# EAGLE design ver3 (EAGLE 9.6.2)
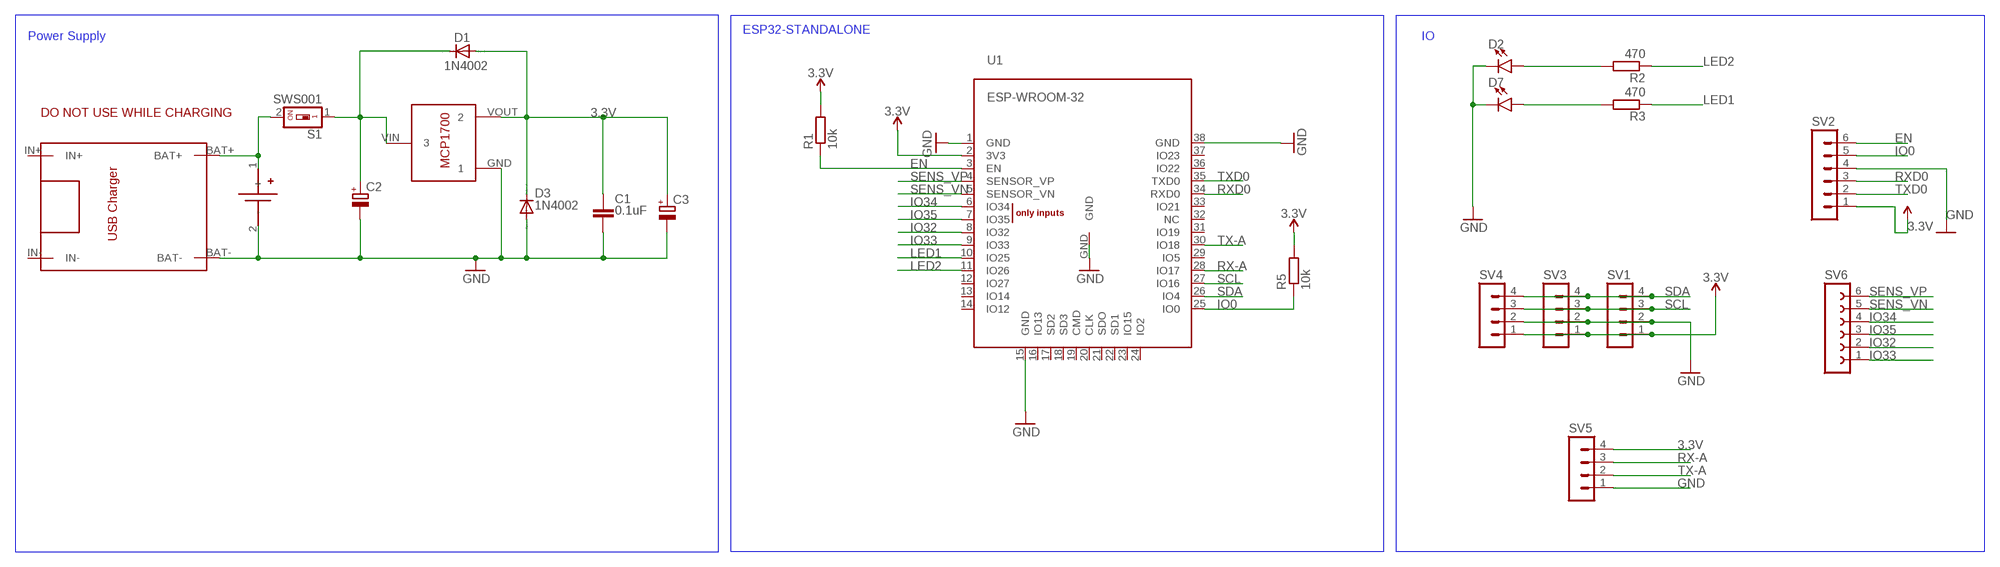
[diagram p0: schematic, sheet 1]

## Parts
C1  0.1uF  C-EU075-052X106  [C075-052X106]
C2  CPOL-EU085CS-1AR  [085CS_1AR]
C3  CPOL-EU085CS-1AR  [085CS_1AR]
D1  1N4002  1N4004  [DO41-10]
D2  LED-3MM-NO_SILK  [LED_3MM-NS]
D3  1N4002  1N4004  [DO41-10]
D7  LED-3MM-NO_SILK  [LED_3MM-NS]
R1  10k  R-EU_R0603  [R0603]
R2  470  R-EU_R0603  [R0603]
R3  470  R-EU_R0603  [R0603]
R5  10k  R-EU_R0603  [R0603]
S1  SWS001  [SMS-001]
SV1  MA04-1  [MA04-1]
SV2  MA06-1  [MA06-1]
SV3  MA04-1  [MA04-1]
SV4  MA04-1  [MA04-1]
SV5  MA04-1  [MA04-1]
SV6  FE06-1  [FE06]
U1  ESP-WROOM-32  [ESP-WROOM-32]
U$1  BLOSSOM-BLM-18650-1PCS  [BLOSSOM-BLM-18650-1PCS]
U$2  TP4056  [TP4056]
U$3  MCP1700T-3302E/TT  [MCP1700T-3302E/TT]

## Nets
3.3V: C1.1 C3.+ D1.A D3.C R1.2 R5.2 SV1.1 SV2.1 SV3.1 SV4.1 SV5.4 U1.2(3V3) U$3.VOUT
EN: R1.1 SV2.6 U1.3(EN)
GND: C1.2 C2.- C3.- D2.K(C) D3.A D7.K(C) SV1.2 SV2.4 SV3.2 SV4.2 SV5.1 U1.1(GND) U1.15(GND) U1.38(GND) U1.GND U$1.2(-) U$2.BAT- U$3.GND
GREEN-A: D7.A R3.2
IO0: R5.1 SV2.5 U1.25(IO0)
IO32: SV6.2 U1.8(IO32)
IO33: SV6.1 U1.9(IO33)
IO34: SV6.4 U1.6(IO34)
IO35: SV6.3 U1.7(IO35)
LED1: R3.1 U1.10(IO25)
LED2: R2.1 U1.11(IO26)
N$5: S1.2 U$1.1(+) U$2.BAT+
RX-A: SV5.3 U1.28(IO17)
RXD0: SV2.3 U1.34(RXD0)
SCL: SV1.3 SV3.3 SV4.3 U1.27(IO16)
SDA: SV1.4 SV3.4 SV4.4 U1.26(IO4)
SENS_VN: SV6.5 U1.5(SENSOR_VN)
SENS_VP: SV6.6 U1.4(SENSOR_VP)
TX-A: SV5.2 U1.30(IO18)
TXD0: SV2.2 U1.35(TXD0)
VIN: C2.+ D1.C S1.1 U$3.VIN
YELLOW-A: D2.A R2.2
Unconnected: U1.12(IO27) U1.13(IO14) U1.14(IO12) U1.16(IO13) U1.17(SD2) U1.18(SD3) U1.19(CMD) U1.20(CLK) U1.21(SDO) U1.22(SD1) U1.23(IO15) U1.24(IO2) U1.29(IO5) U1.31(IO19) U1.32(NC) U1.33(IO21) U1.36(IO22) U1.37(IO23) U$2.IN+ U$2.IN-

## Notes on the sheet
- ESP32-STANDALONE
- Power Supply | IO
- DO NOT USE WHILE CHARGING

## Library data of the parts
C1 = rcl:C-EU: CAPACITOR, European symbol
C2 C3 = rcl:CPOL-EU: POLARIZED CAPACITOR, European symbol; SPICEPREFIX: C
D1 D3 = diode:1N4004: DIODE general purpose rectifier, 1 A
D2 D7 = SparkFun-LED:LED: LED (Generic) Standard schematic elements and footprints for 5mm, 3mm, 1206, and 0603 sized LEDs. Generic LEDs with no color specified.
R1-R3 R5 = rcl:R-EU_: RESISTOR, European symbol
S1 = smd-special:SWS001: SMD Dip Switch 1 pol.
SV1 SV3-SV5 = con-lstb:MA04-1: PIN HEADER; OC_FARNELL: unknown; OC_NEWARK: unknown
SV2 = con-lstb:MA06-1: PIN HEADER; OC_FARNELL: unknown; OC_NEWARK: unknown
SV6 = con-lsta:FE06-1: FEMALE HEADER; OC_FARNELL: unknown; OC_NEWARK: unknown
U1 = bSmart:ESP-WROOM-32: ESP32 mod by bSmart
U$1 = battery-holders:BLOSSOM-BLM-18650-1PCS
U$2 = TP4056 charging module:TP4056
U$3 = MCP1700T-3302E_TT:MCP1700T-3302E/TT: Microchip LDO "MCP1700" in a 3-Pin SOT-23 package. ID: MCP1700T-3302E/TT

## Board
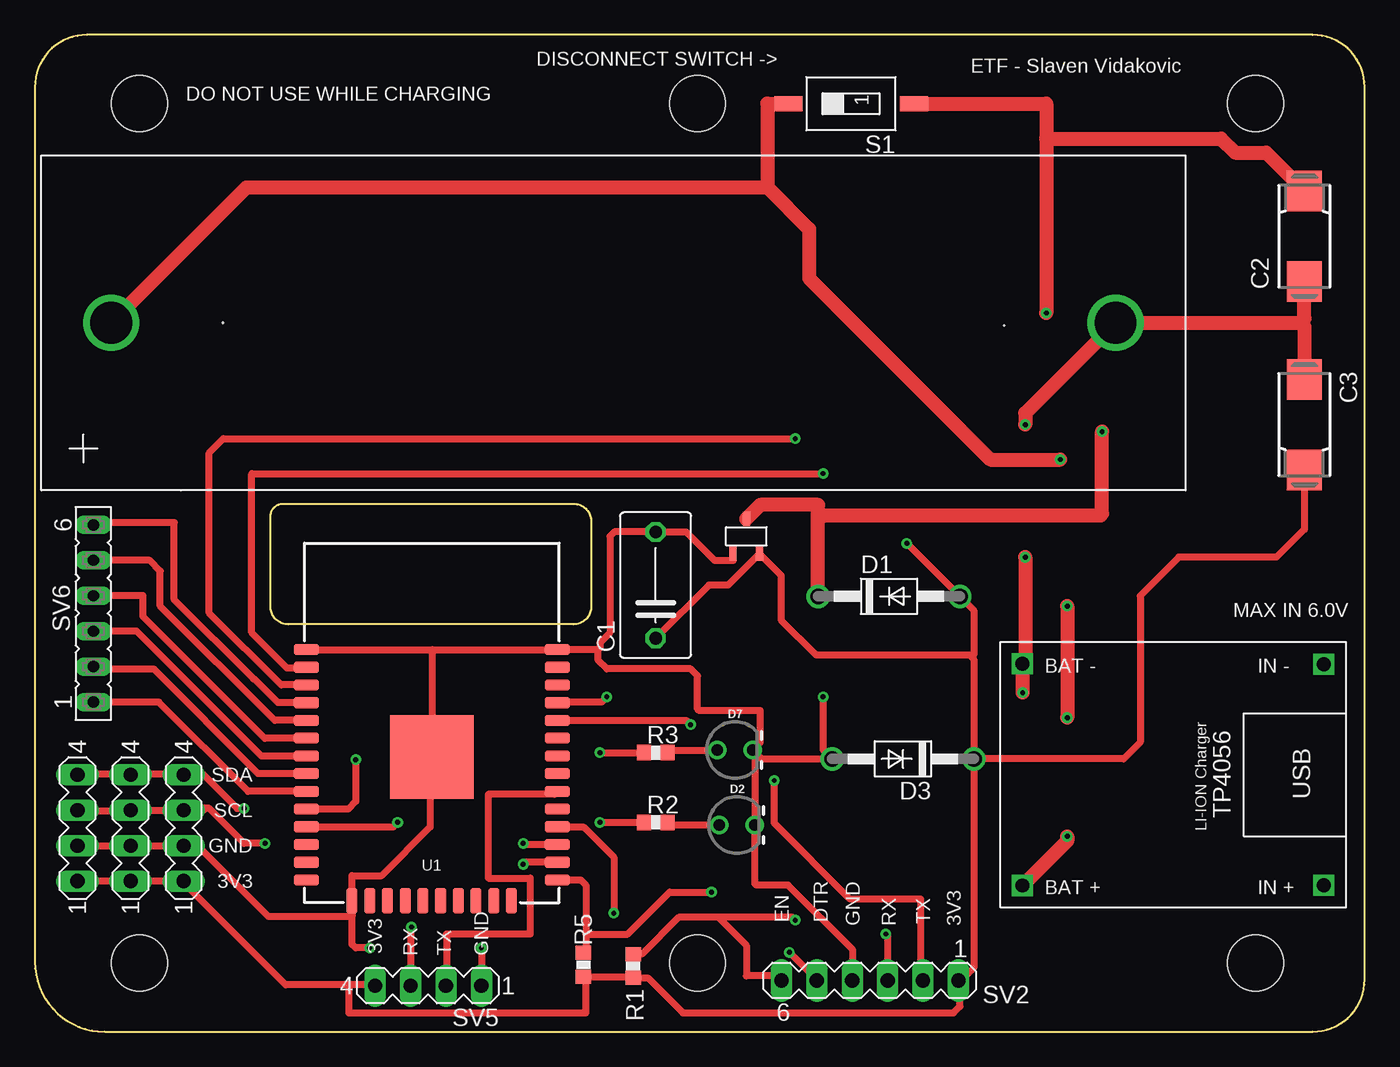
[diagram p1: board, top side]
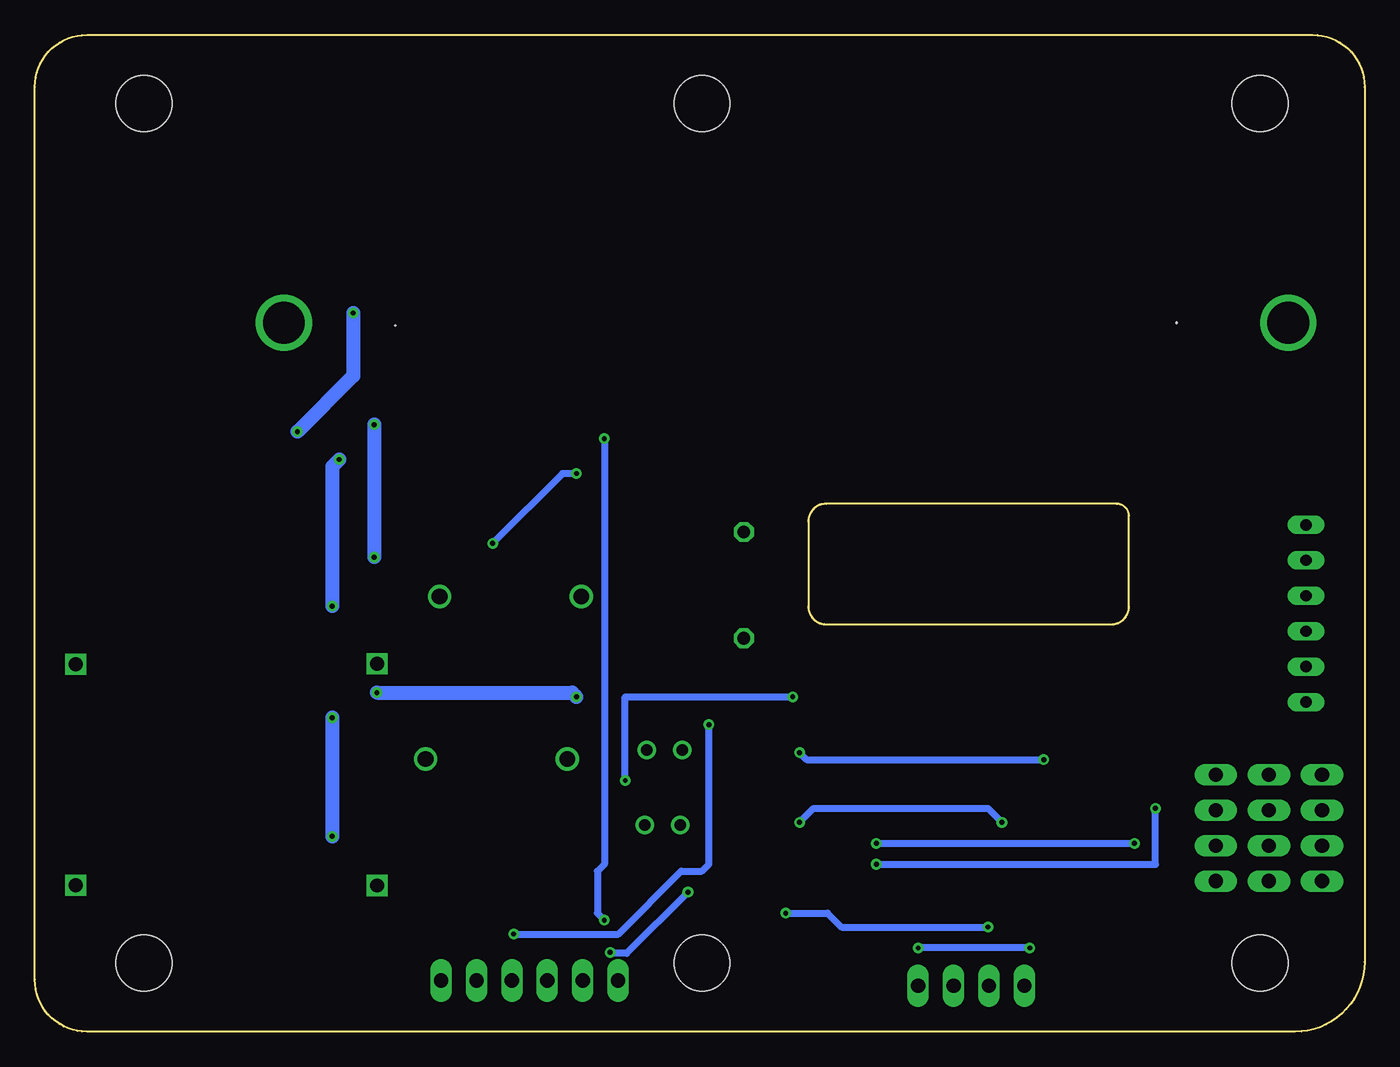
[diagram p2: board, bottom side, seen from below]

Size 95.32 x 71.43 mm. Coordinates in mm from the lower left corner, seen from the top.
Outline: 16.89,30.46 16.89,36.94 arc-90 17.78,37.83 38.61,37.83 arc-90 39.88,36.56 39.88,30.46 arc-90 38.61,29.19 18.16,29.19 arc-90 16.89,30.46
Outline: 5,0 91.59,0 arc90 95.32,3.73 95.32,67.7 arc90 91.59,71.43 3.73,71.43 arc90 0,67.7 0,5 arc90 5,0
Copper layers (1*16): Top 0.035mm / dielectric 1.5mm / Bottom 0.035mm
Design rules "default *": minimum track width 6mil, minimum drill 0.35mm, track to track 6mil, track to pad 6mil, pad to pad 6mil, via to via 6mil, smd to smd 6mil, copper to edge 40mil, drill to drill 6mil, minimum pad ring 10mil, minimum via ring 8mil, stop-mask expansion 4mil, vias tented up to drill 1mm, thermal gap 10mil
Holes 4 mm at 7.5,4.92 47.5,4.92 7.5,66.51 87.5,66.51 87.5,4.92 47.5,66.51

### Footprints (pad centres in the part's own frame; a part is rotated, then mirrored left to right if it is on the bottom)
C075-052X106 = drill 0.914 octagon: 1 -3.81,0; 2 3.81,0
085CS_1AR = smd 2.9 x 2.5: + 3.25,0; - -3.25,0
DO41-10 = drill 1.118: A 5.08,0; C -5.08,0
LED_3MM-NS = drill 0.813: A -1.27,0; K 1.27,0
R0603 = smd 1 x 1.1: 1 -0.85,0; 2 0.85,0
SMS-001 = smd 1.092 x 2.007: 1 0,-4.496; 2 0,4.496
MA04-1 = drill 1.016 long: 1 -3.81,0; 2 -1.27,0; 3 1.27,0; 4 3.81,0
MA06-1 = drill 1.016 long: 1 -6.35,0; 2 -3.81,0; 3 -1.27,0; 4 1.27,0; 5 3.81,0; 6 6.35,0
FE06 = drill 0.813 long: 1 -6.35,0; 2 -3.81,0; 3 -1.27,0; 4 1.27,0; 5 3.81,0; 6 6.35,0
ESP-WROOM-32 = smd 0.8 x 1.8: 1 7.7,9; 2 6.43,9; 3 5.16,9; 4 3.89,9; 5 2.62,9; 6 1.35,9; 7 0.08,9; 8 -1.19,9; 9 -2.46,9; 10 -3.73,9; 11 -5,9; 12 -6.27,9; 13 -7.54,9; 14 -8.81,9; 25 -8.81,-9; 26 -7.54,-9; 27 -6.27,-9; 28 -5,-9; 29 -3.73,-9; 30 -2.46,-9; 31 -1.19,-9; 32 0.08,-9; 33 1.35,-9; 34 2.62,-9; 35 3.89,-9; 36 5.16,-9; 37 6.43,-9; 38 7.7,-9 | smd 1.8 x 0.8: 15 -10.3,5.715; 16 -10.3,4.445; 17 -10.3,3.175; 18 -10.3,1.905; 19 -10.3,0.635; 20 -10.3,-0.635; 21 -10.3,-1.905; 22 -10.3,-3.175; 23 -10.3,-4.445; 24 -10.3,-5.715 | smd 6 x 6: GND 0,0
BLOSSOM-BLM-18650-1PCS = drill 3: 1 -72,0; 2 0,0 | hole 0.089: -64,0; -8,-0.19
TP4056 = drill 1 pad 1.422 square: BAT+ 8.572,-10.477; BAT- -7.303,-10.477; IN+ 8.565,11.105; IN- -7.295,11.105
MCP1700T-3302E/TT = smd 0.5 x 1: GND -0.95,-1.25; VIN 0,1.25; VOUT 0.95,-1.25

### Placement (x,y rotation side)
C1  44.5,32 90 top
C2  91,57 90 top
C3  91,43.5 270 top
D1  61.23,31.2 0 top
D2  50.34,14.81 0 top
D3  62.23,19.55 180 top
D7  50.19,20.18 0 top
R1  42.89,4.71 270 top
R2  44.5,15 0 top
R3  44.5,20 0 top
R5  39.32,4.79 270 top
S1  58.5,66.5 90 top
SV1  3.05,14.61 90 top
SV2  59.86,3.67 180 top
SV3  6.86,14.61 90 top
SV4  10.67,14.61 90 top
SV5  28.19,3.3 180 top
SV6  4.19,29.97 90 top
U1  28.45,19.68 90 top
U$1  77.47,50.8 0 top
U$2  81.28,19.05 270 top
U$3  51,35.5 0 top

### Tracks (layer width: path | path; a pad name or v marks a point on that pad's centre or on a via)
3.3V  (via drill 0.35)
  Top 0.152: 3.05,10.82 SV1.1 | 6.86,10.82 SV3.1 | 19.36,26.06 U1.2 | 10.67,10.67 SV4.1
  Top 0.508: SV5.4 24.33,3.35 22.5,3.35 | 10.67,10.67 17.98,3.35 22.5,3.35 | SV4.1 6.88,10.79 6.86,10.82 | SV3.1 SV1.1 | v62.5,35 v62.51,35 D1.A 67.31,30.2 67.31,27 67,27 | 22.5,3.35 22.5,1.35 39.5,1.35 39.5,3.76 R5.2 42.8,3.94 R1.2 43.94,3.85 46.45,1.35 65.85,1.35 66.31,1.81 66.31,3.57 | 19.36,26.06 19.34,26.08 18.06,26.08 15.54,28.59 15.54,40 v56.5,40 | C1.1 48.31,32 49.7,32 U$3.VOUT 53.5,32.7 53.5,29.5 56,27 67,27 | 67,27 67.31,26.69 D3.C | D3.C 78.05,19.55 79.24,20.74 79.24,31.24 82,34 89,34 91,36 C3.+ | 66.31,3.57 SV2.1 | 66.31,3.57 67.31,4.57 D3.C
  Bottom 0.152: 10.67,10.82 SV4.1
  Bottom 0.508: v62.5,35 57.5,40 v56.5,40
EN  (via drill 0.35)
  Top 0.152: 19.51,24.84 U1.3
  Top 0.508: U1.3 17.66,24.84 12.5,30 12.5,41.5 13.5,42.5 v54.5,42.5 | v54.5,8 54.31,8.19 49,8.19 | R1.1 43.51,5.55 46.15,8.19 49,8.19 | 49,8.19 51,6.19 51,4 53.18,4 SV2.6
  Bottom 0.508: v54.5,8 55,8.5 55,11.5 54.5,12 v54.5,42.5
GND  (via drill 0.35)
  Top 0.152: 77.57,50.9 U$1.2 | 22.86,8.99 22.86,9.3 U1.15 | U1.15 22.71,9.45 22.55,9.45 U1.15 | 28.35,19.5 28.35,19.66 U1.GND 28.5,19.81 29.57,19.81 | 3.05,13.41 SV1.2 | 10.67,13.41 SV4.2 10.67,13.26
  Top 0.508: v32,6 SV5.1 | 22.73,8.27 16.73,8.27 11.66,13.34 SV4.2 SV3.2 SV1.2 | 40.38,27.39 40.5,27.5 40.5,27.87 41.22,28.59 41.22,35.5 41.53,35.81 C1.2 46.69,35.81 48.75,33.75 50.05,33.75 U$3.GND | 40.38,27.39 40.38,26.61 41,26 47,26 47.5,25.5 47.5,23.12 47.62,23 52,23 52,20.73 D7.K | v56.5,24 56.5,20.2 D3.A 52.09,19.55 D7.K | v24,6 23,6 22.73,6.27 22.73,8.27 | 28.35,19 28.35,19.5 | 28.35,19 28.5,19.15 28.5,27.39 | 28.35,19 28.35,14.68 24.86,11.19 22.73,11.19 U1.15 22.73,8.27 | 40.38,27.39 U1.38 28.5,27.39 | D7.K 51.6,20.04 D2.K 51.6,10.61 51.71,10.5 54,10.5 58.59,5.91 SV2.4 | U1.1 28.5,27.39
  Top 1.016: v71,43.5 71,44.33 U$1.2 90.7,50.8 | v71,34 71,26.55 U$2.BAT- v70.8,24.3 | 90.7,50.8 91,50.5 C3.- | 90.7,50.8 91,51.1 C2.-
  Bottom 0.152: 77.42,50.75 U$1.2
  Bottom 0.508: v24,6 v32,6
  Bottom 1.016: v71,43.5 v71,34 | v70.8,24.3 56.8,24.3 v56.5,24
GREEN-A
  Top 0.508: R3.2 45.53,20.18 D7.A
IO0  (via drill 0.35)
  Top 0.152: 39.32,5.84 R5.1 39.32,5.69 | 37.49,10.97 U1.25
  Top 0.508: U1.25 39.12,10.88 39.5,10.5 39.5,7 | 39.5,7 39.5,5.83 R5.1 | v48.5,10 45.5,10 42.5,7 39.5,7 | v54.08,5.69 56.05,3.73 SV2.5
  Bottom 0.508: v48.5,10 52.9,5.61 54,5.61 | 54,5.61 54.12,5.61 | 54,5.61 v54.08,5.69
IO32
  Top 0.152: 19.36,18.59 U1.8
  Top 0.508: U1.8 16,18.5 8.5,26 4.35,26 SV6.2
IO33
  Top 0.152: 19.36,17.37 U1.9
  Top 0.508: U1.9 15.28,17.23 8.88,23.62 SV6.1
IO34
  Top 0.152: 19.36,21.18 U1.6
  Top 0.508: U1.6 16.54,21.04 16.5,21 7.76,29.74 7.76,31.24 SV6.4
IO35
  Top 0.152: 19.36,19.81 U1.7
  Top 0.508: U1.7 16.23,19.77 7.3,28.7 SV6.3
LED1  (via drill 0.35)
  Top 0.152: 19.81,16 19.51,16 U1.10
  Top 0.508: v23,19.5 23,16.5 22.45,15.96 U1.10 | v40.5,20 R3.1
  Bottom 0.508: v40.5,20 40,19.5 v23,19.5
LED2  (via drill 0.35)
  Top 0.152: 19.81,14.78 19.51,14.78 U1.11
  Top 0.508: U1.11 25.68,14.69 v26,15 | v40.5,15 R2.1
  Bottom 0.508: v26,15 27,16 39.5,16 v40.5,15
N$5  (via drill 0.35)
  Top 1.016: U$1.1 15.17,60.5 52.5,60.5 | 52.5,60.5 52.5,66.5 S1.2 | 52.5,60.5 55.5,57.5 55.5,54 68.5,41 v73.5,41 | v74,30.5 v74,22.5 | v74,14 74,13.68 U$2.BAT+
  Bottom 1.016: v73.5,41 74,40.5 v74,30.5 | v74,22.5 v74,14
RX-A  (via drill 0.35)
  Top 0.152: 37.8,14.63 37.49,14.63 U1.28
  Top 0.508: U1.28 39.31,14.69 41.5,12.5 v41.5,8.5 | v27,7.5 26.92,7.5 SV5.3
  Bottom 0.508: v41.5,8.5 38.5,8.5 37.5,7.5 v27,7.5
RXD0  (via drill 0.35)
  Top 0.152: 37.8,22.25 37.49,22.25 U1.34
  Top 0.508: U1.34 46.7,22.3 v47,22 | v61,7 61.13,6.87 SV2.3
  Bottom 0.508: v61,7 53.5,7 49,11.5 47.5,11.5 47,12 v47,22
SCL  (via drill 0.35)
  Top 0.152: 37.34,13.41 U1.27 | SV3.3 6.86,15.85 10.67,15.85 SV4.3
  Top 0.508: SV1.3 3.07,15.85 6.86,15.85 | SV3.3 SV4.3 | SV4.3 12.12,15.88 | U1.27 35.09,13.41 v35,13.5 | v16.5,13.5 15,13.5 12.5,16 10.79,16 SV4.3
  Bottom 0.152: 10.67,15.85 SV4.3
  Bottom 0.508: v35,13.5 v16.5,13.5
SDA  (via drill 0.35)
  Top 0.152: 6.86,18.44 6.5,18.44 3.05,18.44 SV1.4 | 37.34,12.19 U1.26 | 6.86,18.44 10.67,18.44 SV4.4 | 6.86,18.44 SV3.4
  Top 0.508: U1.26 35.15,12.14 v35,12 | v15,16 14.5,16 12.09,18.41 SV4.4 10.64,18.44 6.5,18.44 | SV3.4 6.83,18.44 3.05,18.44
  Bottom 0.152: 10.67,18.29 SV4.4
  Bottom 0.508: v35,12 15,12 v15,16
SENS_VN
  Top 0.152: 19.36,22.4 U1.5
  Top 0.508: U1.5 17.2,22.3 9,30.5 9,33 8.25,33.75 8.22,33.78 SV6.5
SENS_VP
  Top 0.152: 19.36,23.62 U1.4
  Top 0.508: U1.4 17.43,23.57 15.72,25.28 15.68,25.28 10,30.95 10,36.5 4.37,36.5 SV6.6
TX-A
  Top 0.152: 36.73,17.22 37.34,17.22 U1.30
  Top 0.508: U1.30 37.22,17 32.5,17 32.5,11 35.5,11 35.5,7 29.5,7 29.5,3.34 SV5.2
TXD0  (via drill 0.35)
  Top 0.152: 37.49,23.62 U1.35
  Top 0.508: v53,18 53,14.94 58.44,9.5 63.5,9.5 63.5,3.84 SV2.2 | v41,24 40.62,23.62 37.49,23.62
  Bottom 0.508: v53,18 53,24 v41,24
VIN  (via drill 0.35)
  Top 1.016: D1.C 56.15,36.65 | 56.15,36.65 56.15,37.75 52,37.75 U$3.VIN | 56.15,36.65 56.5,37 76.38,37 76.5,37.12 v76.5,43 | S1.1 72.5,66.5 72.5,64 | 72.5,64 v72.5,51.5 | 72.5,64 85.03,64 86.04,62.99 88.26,62.99 C2.+
  Bottom 0.152: 56.15,31.3 D1.C
  Bottom 1.016: v72.5,51.5 72.5,47 v76.5,43
YELLOW-A
  Top 0.508: D2.A 45.54,14.81 R2.2

### Text on the board
tPlace: DISCONNECT SWITCH -> | ETF - Slaven Vidakovic | DO NOT USE WHILE CHARGING | MAX IN 6.0V | SDA | SCL | GND | 3V3 | EN | DTR | GND | RX | TX | 3V3 | 3V3 | RX | TX | GND